# EAGLE design k-line-adapter (EAGLE 9.3.0)

## Sheet 1 of 3: Power Supply
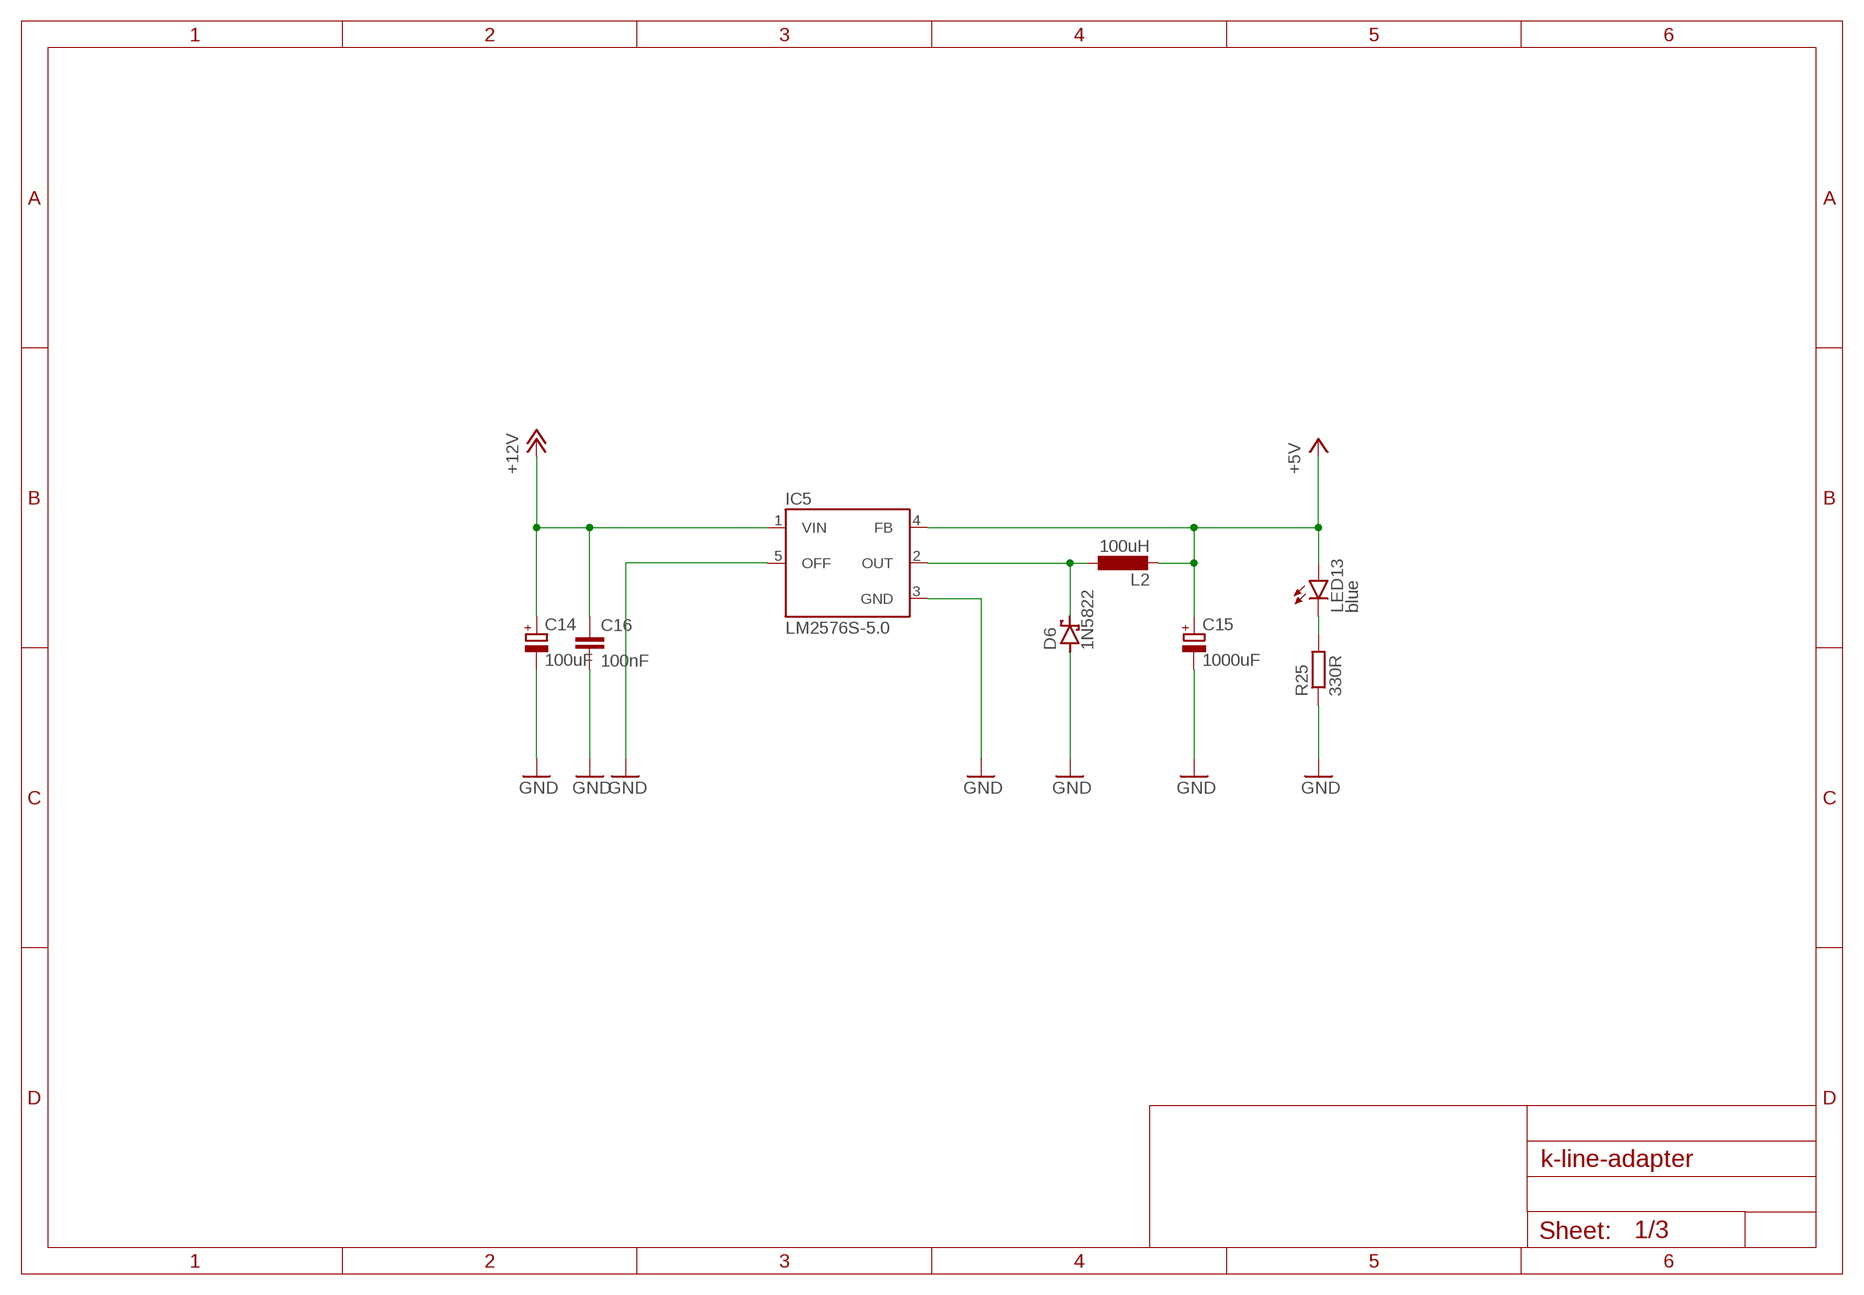
[diagram p0: schematic, sheet 1]

### Parts
C14  100uF  CPOL-EUE5-10.5  [E5-10,5]
C15  1000uF  CPOL-EUE5-10.5  [E5-10,5]
C16  100nF  C-EUC0805  [C0805]
D6  1N5822  SCHOTTKY-DIODEDO201T15  [DO201T15]
IC5  LM2576S-5.0  LM2576S  [TO263-5]
L2  100uH  L-LEU-09HCP  [09HCP]
LED13  blue  LEDCHIP-LED0805  [CHIP-LED0805]
R25  330R  R-EU_R0805  [R0805]

### Nets
+5V: C15.+ IC5.4(FB) L2.P$2 LED13.A ; also sheet 2,3
+12V: C14.+ C16.1 IC5.1(VIN) ; also sheet 3
GND: C14.- C15.- C16.2 D6.A IC5.3(GND) IC5.5(OFF) R25.1 ; also sheet 2,3
N$30: D6.C IC5.2(OUT) L2.P$1
N$31: LED13.C R25.2

## Sheet 2 of 3: RS232 Interface
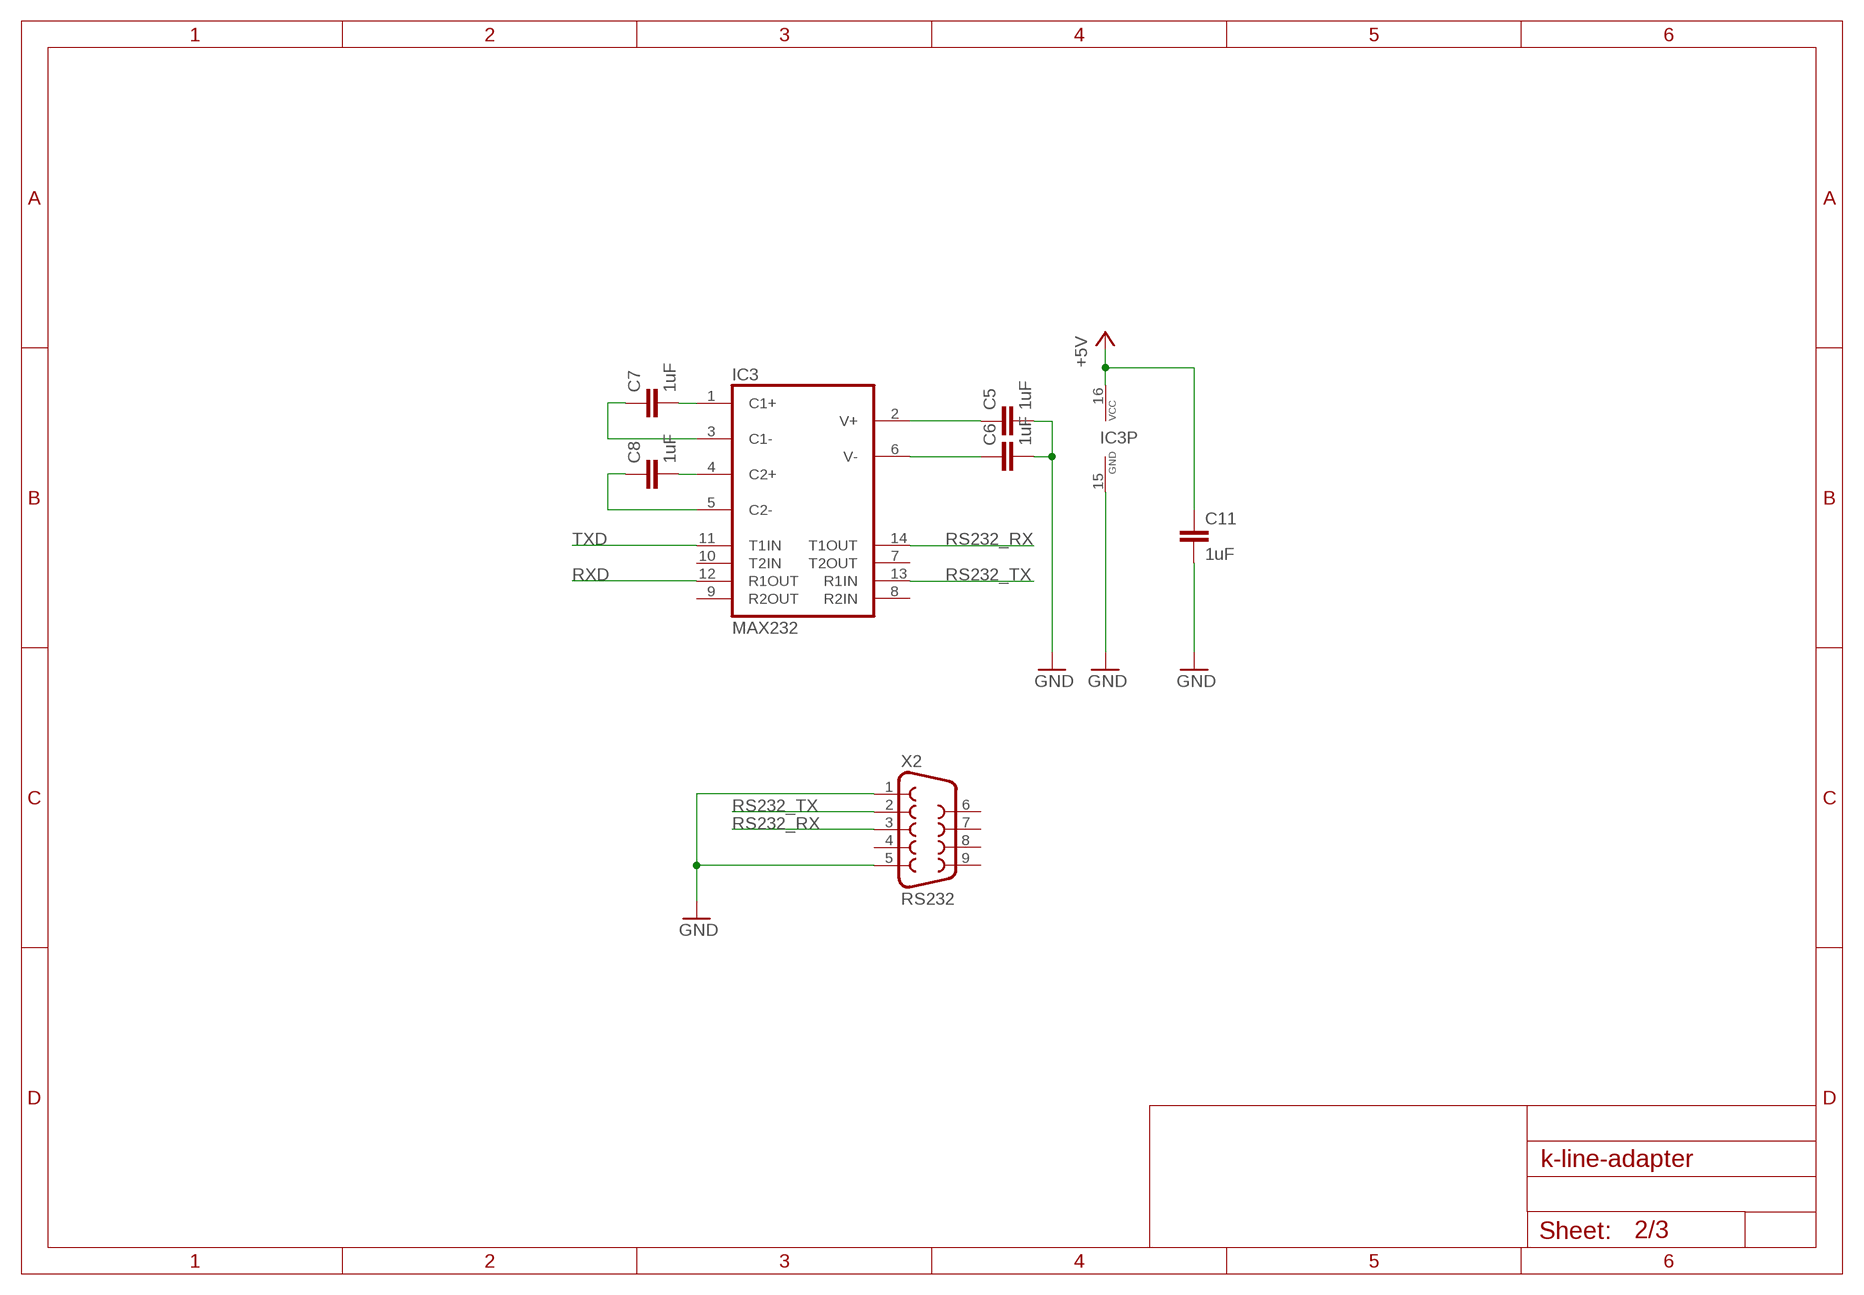
[diagram p1: schematic, sheet 2]

### Parts
C5  1uF  C-EUC0805  [C0805]
C6  1uF  C-EUC0805  [C0805]
C7  1uF  C-EUC0805  [C0805]
C8  1uF  C-EUC0805  [C0805]
C11  1uF  C-EUC0805  [C0805]
IC3  MAX232  [DIL16]
X2  RS232  F09HP  [F09HP]

### Nets
+5V: C11.1 IC3.16(VCC) ; also sheet 1,3
GND: C5.2 C6.2 C11.2 IC3.15(GND) X2.1 X2.5 ; also sheet 1,3
N$11: C5.1 IC3.2(V+)
N$15: C6.1 IC3.6(V-)
N$17: C7.2 IC3.1(C1+)
N$18: C8.2 IC3.4(C2+)
N$19: C8.1 IC3.5(C2-)
N$20: C7.1 IC3.3(C1-)
RS232_RX: IC3.14(T1OUT) X2.3
RS232_TX: IC3.13(R1IN) X2.2
RXD: IC3.12(R1OUT) ; also sheet 3
TXD: IC3.11(T1IN) ; also sheet 3
Unconnected: IC3.7(T2OUT) IC3.8(R2IN) IC3.9(R2OUT) IC3.10(T2IN) X2.4 X2.6 X2.7 X2.8 X2.9

## Sheet 3 of 3: OBDII Interface
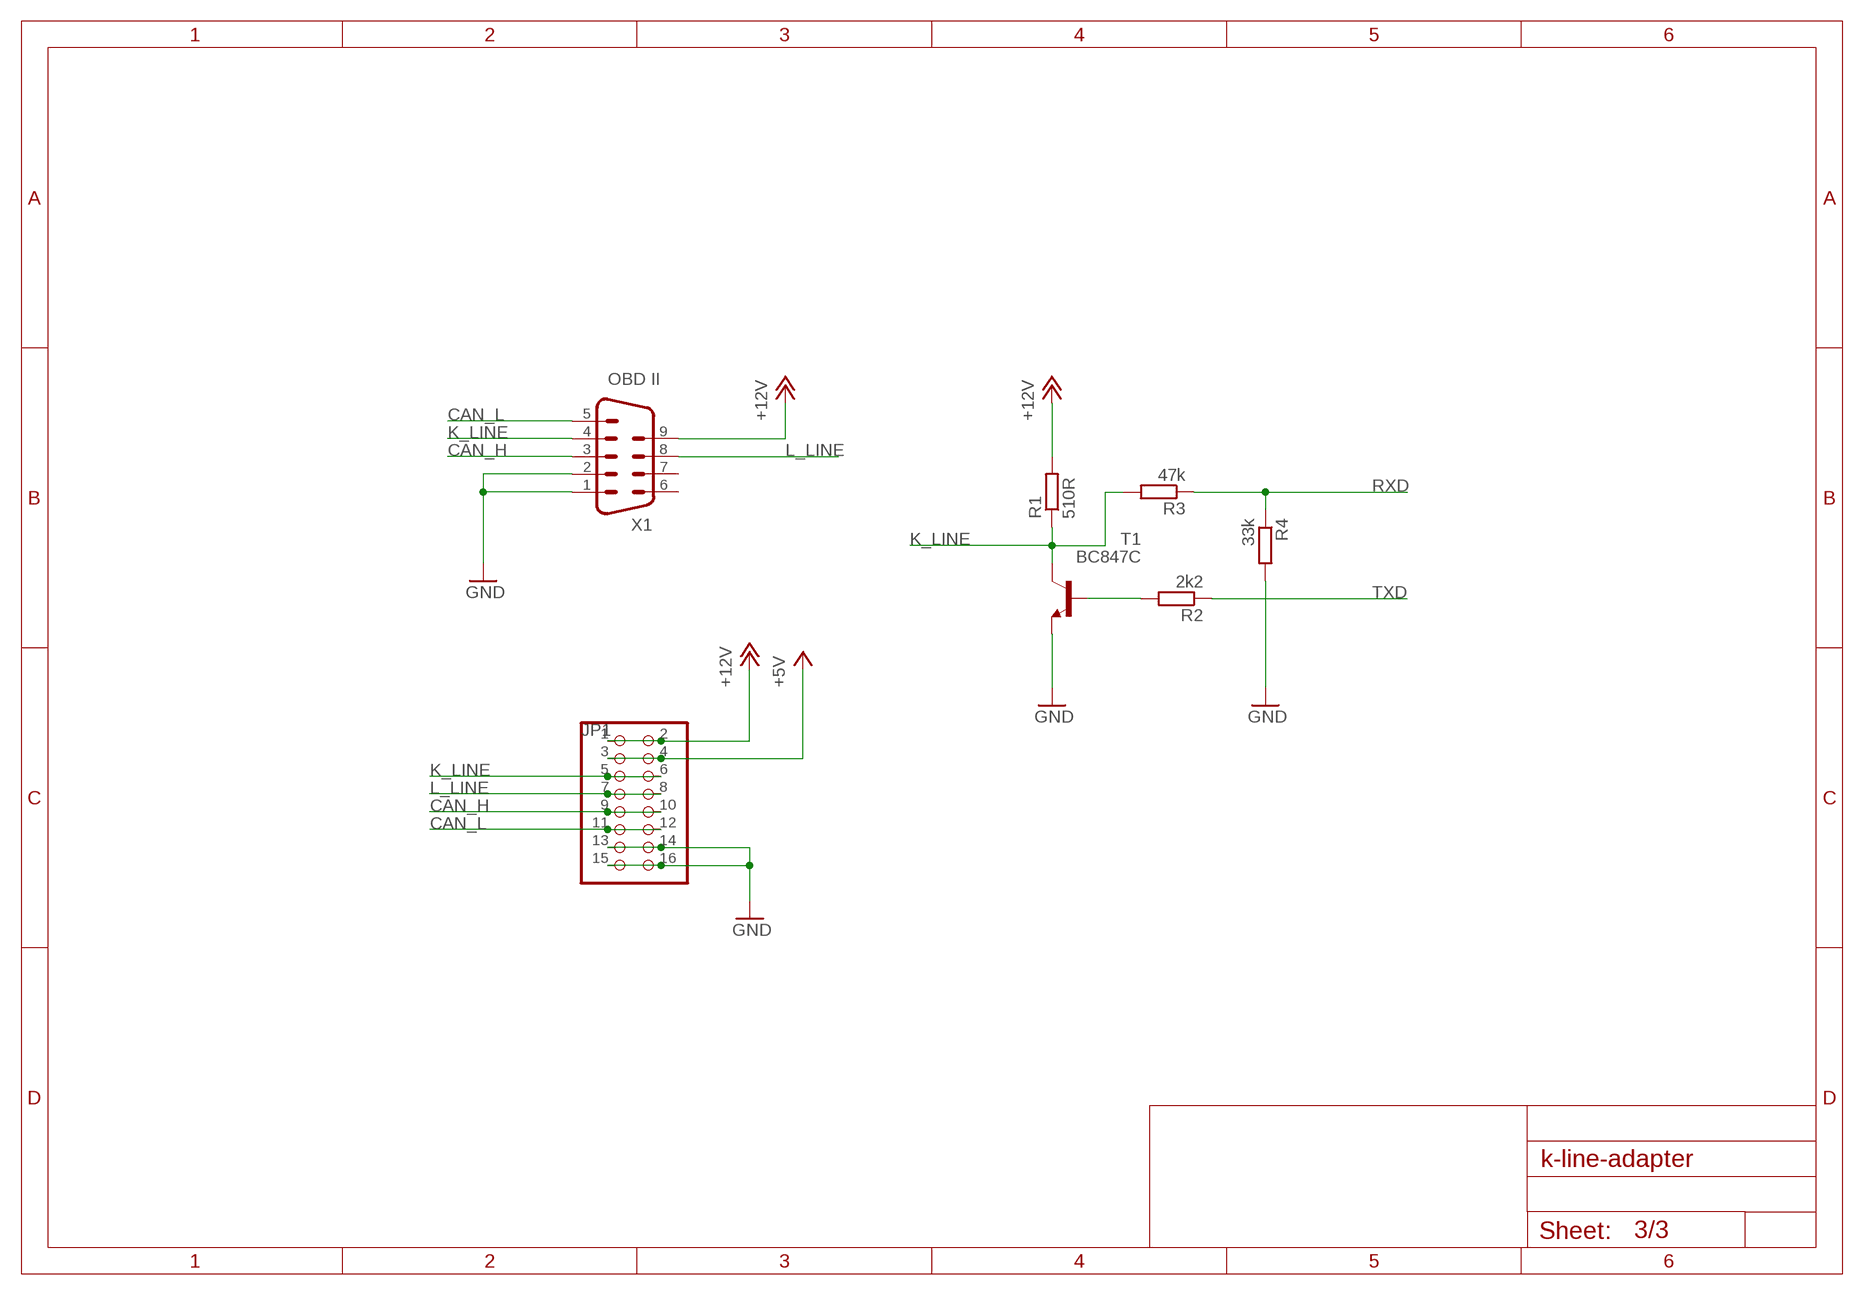
[diagram p2: schematic, sheet 3]

### Parts
JP1  PINHD-2X8  [2X08]
R1  510R  R-EU_R0805  [R0805]
R2  2k2  R-EU_R0805  [R0805]
R3  47k  R-EU_R0805  [R0805]
R4  33k  R-EU_R0805  [R0805]
T1  BC847C  BC847C-NPN-SOT23-BEC  [SOT23-BEC]
X1  M09HP  [M09HP]

### Nets
+5V: JP1.3 JP1.4 ; also sheet 1,2
+12V: JP1.1 JP1.2 R1.2 X1.9 ; also sheet 1
CAN_H: JP1.9 JP1.10 X1.3
CAN_L: JP1.11 JP1.12 X1.5
GND: JP1.13 JP1.14 JP1.15 JP1.16 R4.2 T1.E X1.1 X1.2 ; also sheet 1,2
K_LINE: JP1.5 JP1.6 R1.1 R3.2 T1.C X1.4
L_LINE: JP1.7 JP1.8 X1.8
N$1: R2.2 T1.B
RXD: R3.1 R4.1 ; also sheet 2
TXD: R2.1 ; also sheet 2
Unconnected: X1.6 X1.7

### Notes on the sheet
- OBD II

## Library data of the parts
C5-C8 C11 C16 = rcl:C-EU: CAPACITOR, European symbol; SPICEPREFIX: C
C14 C15 = rcl:CPOL-EU: POLARIZED CAPACITOR, European symbol; SPICEPREFIX: C
D6 = diode:SCHOTTKY-DIODE: Schottky Diode
IC3 = maxim:MAX232: RS232 TRANSCEIVER; MF: MAXIM; MPN: MAX232ACPE+; OC_FARNELL: 9723773; OC_NEWARK: 68K4544
IC5 = v-reg-3:LM2576: National Semiconductor <http://www.national.com> 3.0A "Simple Switcher"(c) 52kHz, Vout 1.23-37V (HV: 57V), Vin 40V (HV: 60V), 50µA standby current
JP1 = pinhead:PINHD-2X8: PIN HEADER
L2 = own_parts:L-LEU-09HCP
LED13 = led:LED: LED OSRAM: - CHIPLED LG R971, LG N971, LY N971, LG Q971, LY Q971, LO R971, LY R971 LH N974, LH R974 LS Q976, LO Q976, LY Q976 LO Q996 - Hyper CHIPLED LW Q18S LB Q993, LB Q99A, LB R99A - SideLED LS A670, LO A670, LY A670, LG A670, LP A670 LB A673, LV A673, LT A673, LW A673 LH A674 LY A675 LS A676, LA A676, LO A676, LY A676, LW A676 LS A679, LY A679, LG A679 - Hyper Micro SIDELED® LS Y876, LA Y876, LO Y876, LY Y876 LT Y87S - SmartLED LW L88C, LW L88S LB L89C, LB L89S, LG L890 LS L89K, LO L89K, LY L89K LS L896, LA L896, LO L896, LY L896 - TOPLED LS T670, LO T670, LY T670, LG T670, LP T670 LSG T670, LSP T670, LSY T670, LOP T670, LYG T670 LG T671, LOG T671, LSG T671 LB T673, LV T673, LT T673, LW T673 LH T674 LS T676, LA T676, LO T676, LY T676, LB T676, LH T676, LSB T676, LW T676 LB T67C, LV T67C, LT T67C, LS T67K, LO T67K, LY T67K, LW E67C LS E67B, LA E67B, LO E67B, LY E67B, LB E67C, LV E67C, LT E67C LW T67C LS T679, LY T679, LG T679 LS T770, LO T770, LY T770, LG T770, LP T770 LB T773, LV T773, LT T773, LW T773 LH T774 LS E675, LA E675, LY E675, LS T675 LS T776, LA T776, LO T776, LY T776, LB T776 LHGB T686 LT T68C, LB T68C - Hyper Mini TOPLED® LB M676 - Mini TOPLED Santana® LG M470 LS M47K, LO M47K, LY M47K Source: http://www.osram.convergy.de LUXEON: - LUMILED® LXK2-PW12-R00, LXK2-PW12-S00, LXK2-PW14-U00, LXK2-PW14-V00 LXK2-PM12-R00, LXK2-PM12-S00, LXK2-PM14-U00 LXK2-PE12-Q00, LXK2-PE12-R00, LXK2-PE12-S00, LXK2-PE14-T00, LXK2-PE14-U00 LXK2-PB12-K00, LXK2-PB12-L00, LXK2-PB12-M00, LXK2-PB14-N00, LXK2-PB14-P00, LXK2-PB14-Q00 LXK2-PR12-L00, LXK2-PR12-M00, LXK2-PR14-Q00, LXK2-PR14-R00 LXK2-PD12-Q00, LXK2-PD12-R00, LXK2-PD12-S00 LXK2-PH12-R00, LXK2-PH12-S00 LXK2-PL12-P00, LXK2-PL12-Q00, LXK2-PL12-R00 Source: www.luxeon.com KINGBRIGHT: KA-3528ASYC Source: www.kingbright.com
R1-R4 R25 = rcl:R-EU_: RESISTOR, European symbol; SPICEPREFIX: R
T1 = transistor:*-NPN-: NPN Transistror BF959 corrected 2008.03.06
X1 = con-subd:M09: SUB-D; OC_FARNELL: unknown; OC_NEWARK: unknown
X2 = con-subd:F09: SUB-D; OC_FARNELL: unknown; OC_NEWARK: unknown

## Board
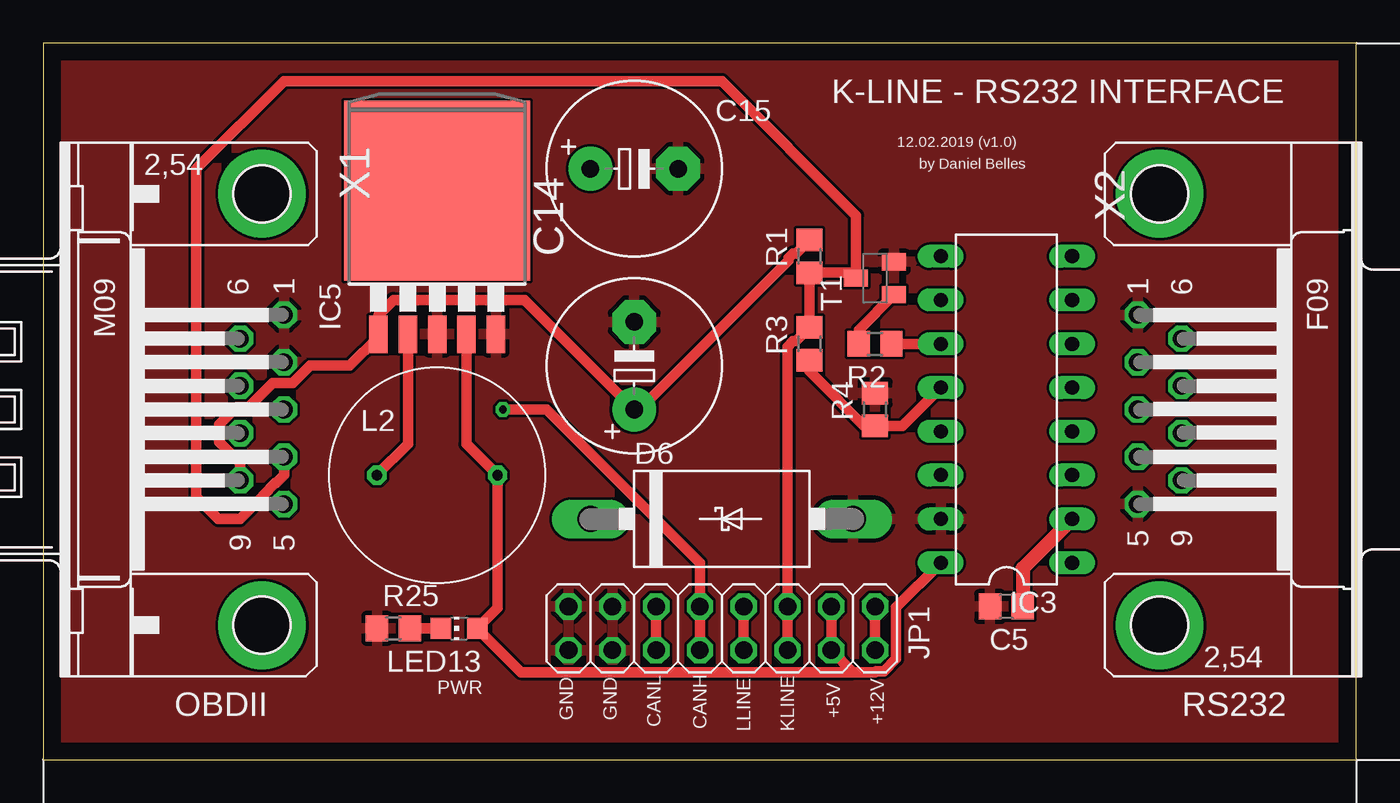
[diagram p3: board, top side]
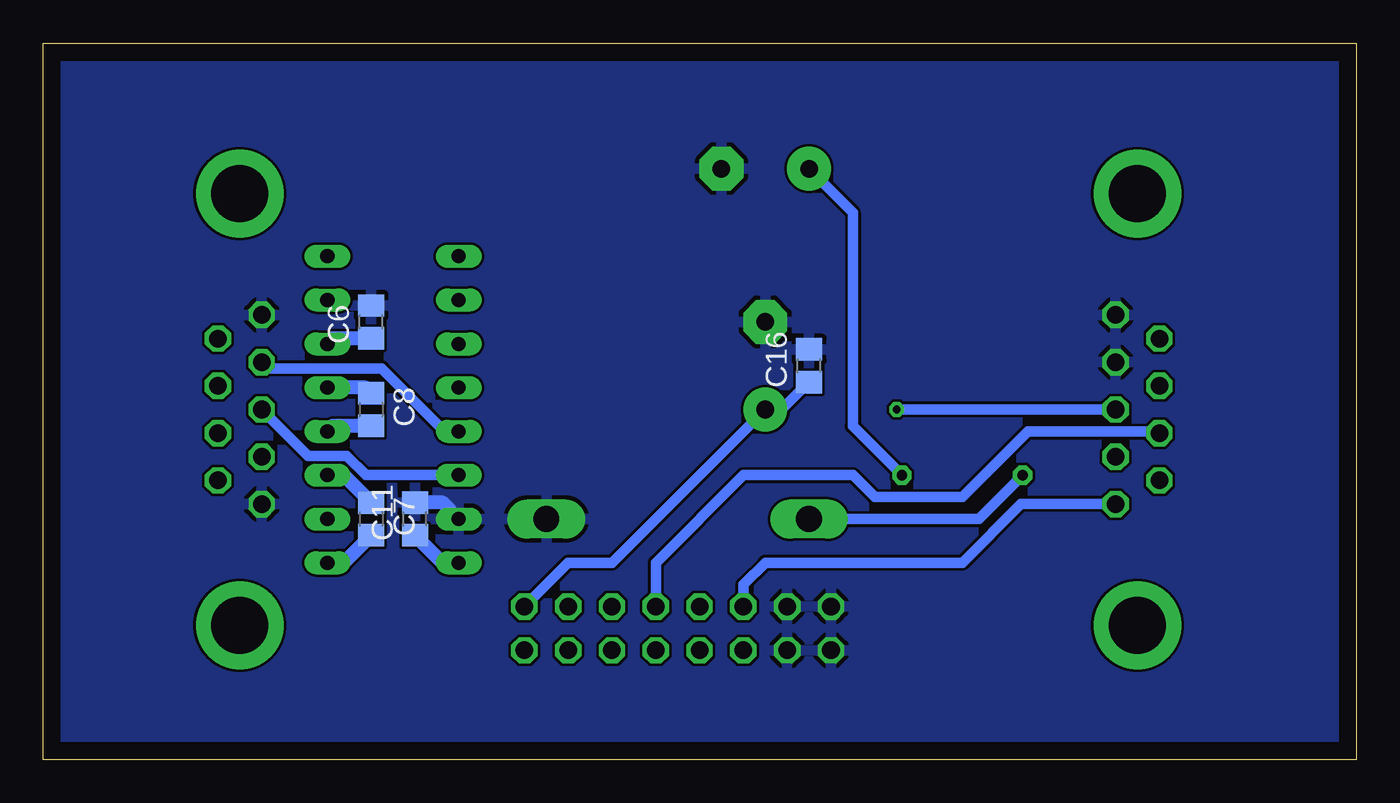
[diagram p4: board, bottom side, seen from below]

Size 76.18 x 41.58 mm. Coordinates in mm from the lower left corner, seen from the top.
Outline: 0,0 76.18,0 76.18,41.58 0,41.58 0,0
Copper layers (1*16): Top 0.035mm / dielectric 1.5mm / Bottom 0.035mm
Design rules "default": minimum track width 6mil, minimum drill 0.35mm, track to track 6mil, track to pad 6mil, pad to pad 6mil, via to via 6mil, smd to smd 6mil, copper to edge 40mil, drill to drill 6mil, minimum pad ring 10mil, minimum via ring 8mil, stop-mask expansion 4mil, vias tented up to drill 0mil, thermal gap 10mil

### Footprints (pad centres in the part's own frame; a part is rotated, then mirrored left to right if it is on the bottom)
C0805 = smd 1.3 x 1.5: 1 -0.95,0; 2 0.95,0
E5-10,5 = drill 1.016 pad 2.54: + -2.54,0 | drill 1.016 pad 2.54 octagon: - 2.54,0
DO201T15 = drill 1.499 long: A 7.62,0; C -7.62,0
DIL16 = drill 0.813 long: 1 -8.89,-3.81; 2 -6.35,-3.81; 3 -3.81,-3.81; 4 -1.27,-3.81; 5 1.27,-3.81; 6 3.81,-3.81; 7 6.35,-3.81; 8 8.89,-3.81; 9 8.89,3.81; 10 6.35,3.81; 11 3.81,3.81; 12 1.27,3.81; 13 -1.27,3.81; 14 -3.81,3.81; 15 -6.35,3.81; 16 -8.89,3.81
TO263-5 = smd 1.067 x 2.159: 1 -3.404,-5.791; 2 -1.702,-5.791; 3 0,-5.791; 4 1.702,-5.791; 5 3.404,-5.791 | smd 10.8 x 10.41: 6 0,2.54
2X08 = drill 1.016 octagon: 1 -8.89,-1.27; 2 -8.89,1.27; 3 -6.35,-1.27; 4 -6.35,1.27; 5 -3.81,-1.27; 6 -3.81,1.27; 7 -1.27,-1.27; 8 -1.27,1.27; 9 1.27,-1.27; 10 1.27,1.27; 11 3.81,-1.27; 12 3.81,1.27; 13 6.35,-1.27; 14 6.35,1.27; 15 8.89,-1.27; 16 8.89,1.27
09HCP = drill 0.6 octagon: P$1 -3.5,0; P$2 3.5,0
CHIP-LED0805 = smd 1.2 x 1.2: A 0,-1.05; C 0,1.05
R0805 = smd 1.3 x 1.5: 1 -0.95,0; 2 0.95,0
SOT23-BEC = smd 1 x 1.4: B -0.95,-1.1; C 0,1.1; E 0.95,-1.1
M09HP = drill 1.016 octagon: 1 -5.486,1.27; 2 -2.743,1.27; 3 0,1.27; 4 2.743,1.27; 5 5.486,1.27; 6 -4.115,-1.27; 7 -1.372,-1.27; 8 1.372,-1.27; 9 4.115,-1.27 | drill 3.302 pad 5.08: G1 -12.522,0; G2 12.522,0
F09HP = drill 1.016 octagon: 1 -5.486,-1.27; 2 -2.743,-1.27; 3 0,-1.27; 4 2.743,-1.27; 5 5.486,-1.27; 6 -4.115,1.27; 7 -1.372,1.27; 8 1.372,1.27; 9 4.115,1.27 | drill 3.302 pad 5.08: G1 -12.522,0; G2 12.522,0

### Placement (x,y rotation side)
C5  55.88,8.89 180 top
C6  57.15,25.4 90 bottom
C7  57.15,13.97 270 bottom
C8  57.15,20.32 270 bottom
C11  54.61,13.97 90 bottom
C14  34.29,22.86 90 top
C15  34.29,34.29 0 top
C16  31.75,22.86 90 bottom
D6  39.37,13.97 0 top
IC3  55.88,20.32 90 top
IC5  22.86,30.48 0 top
JP1  39.37,7.62 180 top
L2  22.86,16.51 0 top
LED13  24.13,7.62 90 top
R1  44.45,29.21 90 top
R2  48.26,24.13 180 top
R3  44.45,24.13 90 top
R4  48.26,20.32 90 top
R25  20.32,7.62 0 top
T1  48.26,27.94 90 top
X1  12.7,20.32 270 top
X2  64.77,20.32 270 top

### Tracks (layer width: path | path; a pad name or v marks a point on that pad's centre or on a via)
+5V
  Top 0.61: IC5.4 24.56,18.31 L2.P$2 26.36,8.8 LED13.A 27.72,5.08 46.99,5.08 | IC3.16 49.48,8.84 49.48,5.84 48.77,5.13 48.31,5.13 48.26,5.08 46.99,5.08 | 46.99,5.08 JP1.4 JP1.3
  Bottom 0.61: C15.+ 29.21,31.75 29.21,19.36 L2.P$2
  Bottom 0.813: C11.1 53.02,11.43 IC3.16
+12V
  Top 0.61: X1.9 11.43,17.22 10.21,18.44 10.21,19 10.16,19.05 10.21,19.1 10.21,19.45 11.23,20.47 11.94,20.47 13.31,21.84 14.47,21.84 15.49,22.86 17.78,22.86 19.46,24.54 IC5.1 19.46,25.81 20.32,26.67 27.94,26.67 C14.+ 34.61,20.32 43.24,28.95 43.24,29.1 43.51,29.37 43.66,29.37 R1.2 | JP1.1 JP1.2
  Bottom 0.61: C16.1 33.34,20.32 C14.+ 43.18,11.43 45.72,11.43 JP1.1
CAN_H  (via drill 0.45)
  Top 0.61: v26.67,20.32 29.21,20.32 38.1,11.43 JP1.9 JP1.10
  Bottom 0.61: X1.3 v26.67,20.32
CAN_L
  Top 0.61: JP1.11 JP1.12
  Bottom 0.61: X1.5 19.46,14.83 22.86,11.43 34.29,11.43 35.56,10.16 JP1.11
GND
  Bottom 0.813: IC3.15 53.02,14.92 C11.2
  pour Bottom: 0,0 76.2,0 76.2,41.91 0,41.91
  pour Top: 0,41.91 76.2,41.91 76.2,0 0,0
K_LINE
  Top 0.61: JP1.6 JP1.5 43.18,23.96 43.51,24.29 43.66,24.29 R3.2 R1.1 46.84,28.26 T1.C 47.16,31.58 39.37,39.37 13.97,39.37 8.89,34.29 8.89,15.24 10.16,13.97 11.43,13.97 12.75,15.29 12.75,15.34 13.46,16.05 13.51,16.05 13.97,16.51 X1.4
L_LINE
  Top 0.61: JP1.8 JP1.7
  Bottom 0.61: JP1.7 40.64,11.43 35.56,16.51 29.21,16.51 27.94,15.24 22.86,15.24 19.05,19.05 11.53,19.05 X1.8
N$1
  Top 0.61: T1.B 47.31,24.94 R2.2
N$11
  Top 0.813: C5.1 56.83,11.11 IC3.2
N$15
  Bottom 0.813: C6.1 59.37,24.45 IC3.6
N$17
  Bottom 0.813: C7.2 58.74,11.43 IC3.1
N$18
  Bottom 0.813: C8.2 59.37,19.37 IC3.4
N$19
  Bottom 0.813: C8.1 57.47,21.59 IC3.5
N$20
  Bottom 0.813: C7.1 58.74,16.51 IC3.3
N$30
  Top 0.61: L2.P$1 21.16,18.31 IC5.2
  Bottom 0.61: D6.C 21.9,13.97 L2.P$1
N$31
  Top 0.61: R25.2 LED13.C
RS232_RX
  Bottom 0.61: X2.3 60.81,17.63 58.57,17.63 57.45,16.51 IC3.14
RS232_TX
  Bottom 0.61: IC3.13 52.88,19.05 56.54,22.71 63.14,22.71 X2.2
RXD
  Top 0.61: R3.1 44.45,22.54 47.94,19.05 R4.1 49.85,19.37 IC3.12
TXD
  Top 0.61: R2.1 IC3.11

### Text on the board
tPlace: K-LINE - RS232 INTERFACE | 12.02.2019 (v1.0) | by Daniel Belles | PWR | OBDII | RS232 | GND | GND | CANL | CANH | LLINE | KLINE | +5V | +12V
layer 255: GND | GND